# Altium project biv2-LRP_1a.PrjPcb
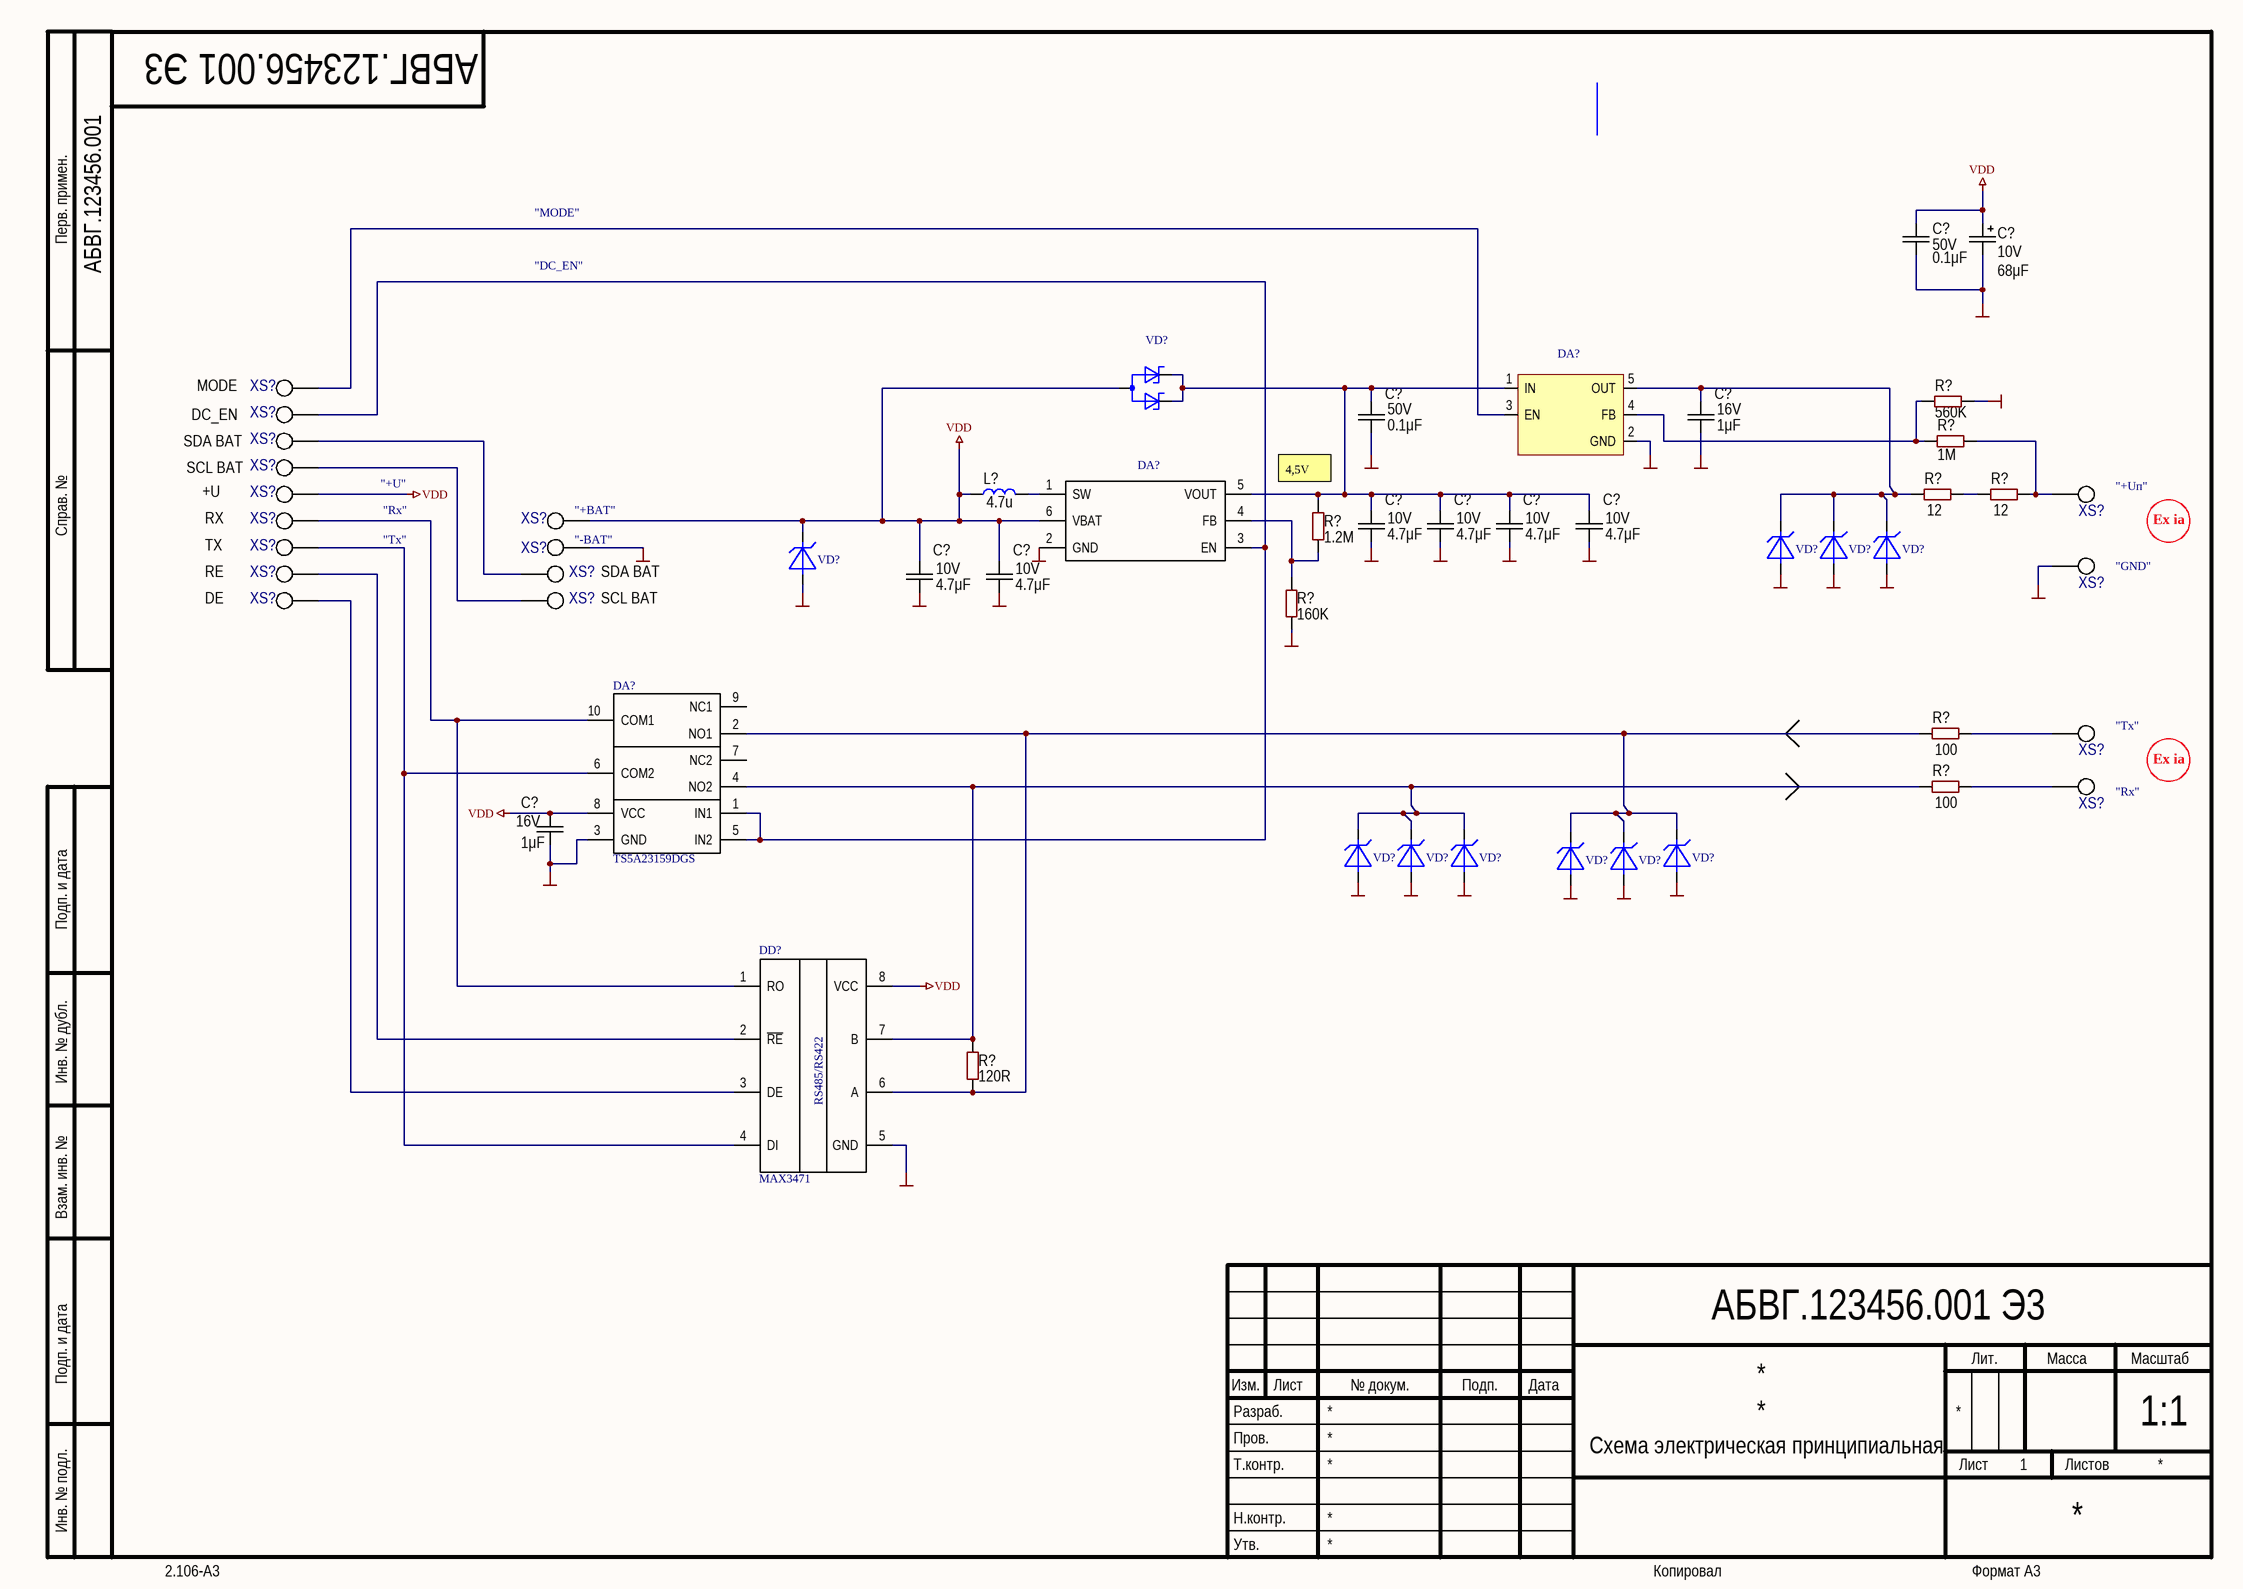
[diagram p0: Sheet1.SchDoc]
1 sheet, 53 parts. Net scope: global (net labels, ports and power ports of the same name join across sheets).
Board file: biv2-LRP_1a.PcbDoc

## Sheet Sheet1.SchDoc
size 420 x 297 mm; Address1: Address1; Address2: Address2; Address3: Address3; Address4: Address4; DocumentNumber: АБВГ.123456.001 Э3; SheetNumber: 1; Scale: 1:1; DocumentType: Схема электрическая принципиальная; FirstReferrence: АБВГ.123456.001

### Parts
(Parts that share a designator on the sheet are numbered #1, #2 ... from top to bottom, then left to right.)
C11  value 68μF  Voltage: 10V  [CAP: TANTAL-B]
C?#1  value 0.1μF  Voltage: 50V  [CAP: 0603]
C?#2  value 0.1μF  Voltage: 50V  [CAP: 0603]
C?#3  value 1μF  Voltage: 16V  [CAP: 0603]
C?#4  value 4.7μF  Voltage: 10V  [CAP: 0603]
C?#5  value 4.7μF  Voltage: 10V  [CAP: 0603]
C?#6  value 4.7μF  Voltage: 10V  [CAP: 0603]
C?#7  value 4.7μF  Voltage: 10V  [CAP: 0603]
C?#8  value 4.7μF  Voltage: 10V  [CAP: 0603]
C?#9  value 4.7μF  Voltage: 10V  [CAP: 0603]
C?#10  value 1μF  Voltage: 16V  [CAP: 0603]
DA1  TS5A23159DGS  [VSSSOP-10 - TI]
DA2  TPS6107x  [SOT23-6]  (value not drawn)
DA3  TPS78001DDC  [SOT23-5]  (value not drawn)
DD1  MAX3471  [MSOP-8]
L1  value 4.7u  [IND: CDRH4D28NP]  (hidden comment: CDRH4D)
R1  value 120R  [RES: 0603]
R2  value 160K  [RES: 0603]
R3  value 1.2M  [RES: 0603]
R4  value 12  [RES: 2512]
R5  value 100  [RES: 2512]
R6  value 100  [RES: 2512]
R7  value 560K  [RES: 0603]
R8  value 1M  [RES: 0603]
R9  value 12  [RES: 2512]
VD1  SM2T  [DO216-AA]  (value not drawn)
VD2  BAT54AW  [SC-70]  (value not drawn)
VD3  SM2T  [DO216-AA]  (value not drawn)
VD4  SM2T  [DO216-AA]  (value not drawn)
VD5  SM2T  [DO216-AA]  (value not drawn)
VD6  SM2T  [DO216-AA]  (value not drawn)
VD7  SM2T  [DO216-AA]  (value not drawn)
VD8  SM2T  [DO216-AA]  (value not drawn)
VD9  SM2T  [DO216-AA]  (value not drawn)
VD10  SM2T  [DO216-AA]  (value not drawn)
VD11  SM2T  [DO216-AA]  (value not drawn)
XS?#1  Testpoint_HS1mm  [TestPoint(1mm_HS)]  (value not drawn)
XS?#2  Testpoint_HS1mm  [TestPoint(1mm_HS)]  (value not drawn)
XS?#3  Testpoint_HS1mm  [TestPoint(1mm_HS)]  (value not drawn)
XS?#4  Testpoint_HS1mm  [TestPoint(1mm_HS)]  (value not drawn)
XS?#5  Testpoint_HS1mm  [TestPoint(1mm_HS)]  (value not drawn)
XS?#6  Testpoint_HS1mm  [TestPoint(1mm_HS)]  (value not drawn)
XS?#7  Testpoint_HS1mm  [TestPoint(1mm_HS)]  (value not drawn)
XS?#8  Testpoint_HS1mm  [TestPoint(1mm_HS)]  (value not drawn)
XS?#9  Testpoint_HS1mm  [TestPoint(1mm_HS)]  (value not drawn)
XS?#10  Testpoint_HS1mm  [TestPoint(1mm_HS)]  (value not drawn)
XS?#11  Testpoint_HS1mm  [TestPoint(1mm_HS)]  (value not drawn)
XS?#12  Testpoint_HS1mm  [TestPoint(1mm_HS)]  (value not drawn)
XS?#13  Testpoint_HS1mm  [TestPoint(1mm_HS)]  (value not drawn)
XS?#14  Testpoint_HS1mm  [TestPoint(1mm_HS)]  (value not drawn)
XS?#15  Testpoint_HS1mm  [TestPoint(1mm_HS)]  (value not drawn)
XS?#16  Testpoint_HS1mm  [TestPoint(1mm_HS)]  (value not drawn)
XS?#17  Testpoint_HS1mm  [TestPoint(1mm_HS)]  (value not drawn)

### Nets
GND: C11.2 C?#1.1 C?#2.1 C?#3.1 C?#4.1 C?#5.1 C?#6.1 C?#7.1 C?#8.1 C?#9.1 C?#10.1 DA1.3(GND) DA2.2(GND) DA3.2(GND) DD1.5(GND) R2.1 R7.1 VD1.2(A) VD3.2(A) VD4.2(A) VD5.2(A) VD6.2(A) VD7.2(A) VD8.2(A) VD9.2(A) VD10.2(A) VD11.2(A) XS?#10.1 XS?#11.1
VDD: C11.1 C?#1.2 C?#8.2 C?#9.2 C?#10.2 DA1.8(VCC) DA2.6(VBAT) DD1.8(VCC) L1.1 VD1.1(C) VD2.3(OA) XS?#5.1 XS?#8.1
NetC?#2_2: C?#2.2 C?#4.2 C?#5.2 C?#6.2 C?#7.2 DA2.5(VOUT) DA3.1(IN) R3.2 VD2.1(C) VD2.2(C)
NetC?#3_2: C?#3.2 DA3.5(OUT) R4.1 VD9.1(C) VD10.1(C) VD11.1(C)
NetDA1_1: DA1.1(IN1) DA1.5(IN2) DA2.3(EN) XS?#2.1
NetDA1_2: DA1.2(NO1) DD1.6(A) R1.1 R5.1 VD6.1(C) VD7.1(C) VD8.1(C)
NetDA1_4: DA1.4(NO2) DD1.7(B) R1.2 R6.1 VD3.1(C) VD4.1(C) VD5.1(C)
NetDA1_6: DA1.6(COM2) DD1.4(DI) XS?#9.1
NetDA1_10: DA1.10(COM1) DD1.1(RO) XS?#7.1
NetDA2_1: DA2.1(SW) L1.2
NetDA2_4: DA2.4(FB) R2.2 R3.1
NetDA3_3: DA3.3(EN) XS?#1.1
NetDA3_4: DA3.4(FB) R7.2 R8.2
NetDD1_2: DD1.2(~{RE}) XS?#12.1
NetDD1_3: DD1.3(DE) XS?#14.1
NetR4_2: R4.2 R9.1
NetR5_2: R5.2 XS?#16.1
NetR6_2: R6.2 XS?#17.1
NetR8_1: R8.1 R9.2 XS?#6.1
NetXS?#3_1: XS?#3.1 XS?#13.1
NetXS?#4_1: XS?#4.1 XS?#15.1

Not connected (* = marked no-connect by the designer): DA1 7(NC2) 9(NC1)

### Notes on the sheet
- "MODE"
- "DC_EN"
- MODE
- (near XS?#3) SDA BAT
- DC_EN
- (near XS?#4) SCL BAT
- +U
- RX
- "+U"
- "Rx"
- (near XS?#8) "+BAT"
- (near R3) 4,5V
- (near XS?#6) "+Uп"
- Ex ia
- TX
- RE
- "Tx"
- (near XS?#10) "-BAT"
- (near XS?#10) SDA BAT
- (near XS?#11) "GND"
- DE
- (near XS?#15) SCL BAT
- (near XS?#16) "Tx"
- (near XS?#17) "Rx"
- Перв. примен.
- Справ. №
- Подп. и дата
- Инв. № дубл.
- Взам. инв. №
- Разраб.
- Изм.
- Лист
- № докум.
- Подп.
- Дата
- Лит.
- Масса
- Масштаб
- Пров.
- Т.контр.
- Листов
- Инв. № подл.
- Утв.
- Н.контр.
- 2.106-A3
- Копировал
- Формат А3
- (in symbol MAX3471) RS485/RS422

### Library data of the parts
C11 = Tantal_B: Manufacturer: AVX; PartNumber: F930J227KBA; ValueManufacturerPartNumber: Tantalum capacitor, 68μF, 10V, ±10%, 1.2Ohm, case B (3528), -55...+125°C; Impedance: 1.2Ohm; Tolerance: ±10%; TypeDielectric: X7R; TypeCapacitor: Tantalum capacitor; Package: 0603; HelpURL: https://www.digikey.com/product-detail/en/yageo/CC0603KRX7R7BB104/311-1088-1-ND/302998; Temperature: -55...+125°C
C?#1 C?#2 = Ceramic_0603: Manufacturer: Yageo; PartNumber: CC0603KRX7R7BB104; ValueManufacturerPartNumber: Ceramic capacitor, 0.1μF, X7R, ±10%, 50V, 0603, -55...+125°C; TypeCapacitor: Ceramic capacitor; Tolerance: ±10%; TypeDielectric: X7R; Package: case B (3528); HelpURL: https://www.digikey.com/product-detail/en/avx-corporation/F930J227KBA/478-8166-1-ND/4005570; Temperature: -55...+125°C
C?#3 C?#10 = Ceramic_0603: Manufacturer: Yageo; PartNumber: CC0603KRX7R7BB104; ValueManufacturerPartNumber: Ceramic capacitor, 1μF, X7R, ±10%, 16V, 0603, -55...+125°C; TypeCapacitor: Ceramic capacitor; Tolerance: ±10%; TypeDielectric: X7R; Package: 0603; HelpURL: https://www.digikey.com/product-detail/en/yageo/CC0603KRX7R7BB104/311-1088-1-ND/302998; Temperature: -55...+125°C
C?#4-C?#9 = Ceramic_0603: Manufacturer: Yageo; PartNumber: CC0603KRX7R7BB104; ValueManufacturerPartNumber: Ceramic capacitor, 4.7μF, X7R, ±10%, 10V, 0603, -55...+125°C; TypeCapacitor: Ceramic capacitor; Tolerance: ±10%; TypeDielectric: X7R; Package: 0603; HelpURL: https://www.digikey.com/product-detail/en/yageo/CC0603KRX7R7BB104/311-1088-1-ND/302998; Temperature: -55...+125°C
DA1 = TS5A23159DGS: Микросхема; Manufacturer: Texas Instruments; ComponentLink1Description: Data Sheet; ComponentLink1URL: http://focus.ti.com/lit/ds/symlink/tps780270200.pdf
DA2 = TPS61070: Микросхема; Manufacturer: Texas Instruments; ComponentLink1Description: Data Sheet; ComponentLink3URL: *; ReplacementPart1Manufacturer: *; ReplacementPart1PartNumber: *; ReplacementPart1TopMarking: *; ReplacementPart2Manufacturer: *; ReplacementPart2PartNumber: *; ReplacementPart2TopMarking: *; TopMarking: *; PartNumber: TPS6107x
DA3 = TPS78001DDC: Микросхема; Manufacturer: Texas Instruments; Part Number: TPS780270200DDCT; PartNumber: TS5A23159DGS
DD1 = MAX3471: RS-485/RS422Half-Duplex,  Differential Transceiver for Battery-Powered Systems; Manufacturer: MAXIM; ComponentLink1Description: Data Sheet; ComponentLink1URL: \\Mskd20virt\KB\PDF\Интерфейсы\RS232_485\MAX3471.pdf; ComponentLink2Description: Replacement 1 Data Sheet; PartNumber: MAX3471
L1 = CDRH4D28NP: ComponentLink1Description: Datasheet; ComponentLink1URL: https://products.sumida.com/products/pdf/CDRH4D28.pdf
R1 = Resistor_0603: Manufacturer: Yageo; PartNumber: RC0603JR-07100RL; ValueManufacturerPartNumber: Resistor film, 120R, ±5%, 0603, 0.1W, -55...+125°C; TypeResistor: Resistor film; Power: 0.1W; Tolerance: ±5%; Package: 0603; HelpURL: https://www.digikey.com/product-detail/en/yageo/RC0603JR-07100RL/311-100GRCT-ND/729644; Temperature: -55...+125°C
R2 = Resistor_0603: Manufacturer: Yageo; PartNumber: RC0603JR-07100RL; ValueManufacturerPartNumber: Resistor film, 160K, ±5%, 0603, 0.1W, -55...+125°C; TypeResistor: Resistor film; Power: 0.1W; Tolerance: ±5%; Package: 0603; HelpURL: https://www.digikey.com/product-detail/en/yageo/RC0603JR-07100RL/311-100GRCT-ND/729644; Temperature: -55...+125°C
R3 = Resistor_0603: Manufacturer: Yageo; PartNumber: RC0603JR-07100RL; ValueManufacturerPartNumber: Resistor film, 1.2M, ±5%, 0603, 0.1W, -55...+125°C; TypeResistor: Resistor film; Power: 0.1W; Tolerance: ±5%; Package: 2512; HelpURL: https://www.digikey.com/product-detail/en/yageo/RC2512JK-07100RL/YAG3393CT-ND/5962215; Temperature: -55...+125°C
R4 R9 = Resistor_2512: Manufacturer: Yageo; PartNumber: RC2512JK-07100RL; ValueManufacturerPartNumber: Resistor film, 12, ±5%, 2512, 1W, -55...+125°C; TypeResistor: Resistor film; Power: 1W; Tolerance: ±5%; Package: 0603; HelpURL: https://www.digikey.com/product-detail/en/yageo/RC0603JR-07100RL/311-100GRCT-ND/729644; Temperature: -55...+125°C
R5 R6 = Resistor_2512: Manufacturer: Yageo; PartNumber: RC2512JK-07100RL; ValueManufacturerPartNumber: Resistor film, 100, ±5%, 2512, 1W, -55...+125°C; TypeResistor: Resistor film; Power: 1W; Tolerance: ±5%; Package: 0603; HelpURL: https://www.digikey.com/product-detail/en/yageo/RC0603JR-07100RL/311-100GRCT-ND/729644; Temperature: -55...+125°C
R7 = Resistor_0603: Manufacturer: Yageo; PartNumber: RC0603JR-07100RL; ValueManufacturerPartNumber: Resistor film, 560K, ±5%, 0603, 0.1W, -55...+125°C; TypeResistor: Resistor film; Power: 0.1W; Tolerance: ±5%; Package: 2512; HelpURL: https://www.digikey.com/product-detail/en/yageo/RC2512JK-07100RL/YAG3393CT-ND/5962215; Temperature: -55...+125°C
R8 = Resistor_0603: Manufacturer: Yageo; PartNumber: RC0603JR-07100RL; ValueManufacturerPartNumber: Resistor film, 1M, ±5%, 0603, 0.1W, -55...+125°C; TypeResistor: Resistor film; Power: 0.1W; Tolerance: ±5%; Package: 0603; HelpURL: https://www.digikey.com/product-detail/en/yageo/RC0603JR-07100RL/311-100GRCT-ND/729644; Temperature: -55...+125°C
VD1 VD3-VD11 = SM2T: TVS Диод; Manufacturer: ST Microelectronics; ComponentLink1Descriprion: Data Sheet; Type: *; Power/Voltage: *; PartNumber: BAT54AW; Package: SC-70; ComponentLink1Description: DataSheet; ComponentLink1URL: http://www.nxp.com/documents/data_sheet/BAT54W.pdf; ComponentLink2URL: http://www.onsemi.com/pub_link/Collateral/BAT54AWT1-D.PDF; ComponentLink3Description: Replacement2DataSheet; ComponentLink3URL: http://www.infineon.com/dgdl/bat54series.pdf?folderId=db3a30431400ef68011425f1ca2505e3&fileId=db3a304314dca3890115190b74210ea6; ComponentLink2Description: Replacement1DataSheet
VD2 = BAT54AW: Сборка диодная; Manufacturer: NXP; ReplacementPart2TopMarking: TA; ReplacementPart1Manufacturer: ON Semiconductor; ReplacementPart1PartNumber: BAT54AWT1G; ReplacementPart1TopMarking: B7*; ReplacementPart2Manufacturer: Infineon; ReplacementPart2PartNumber: BAT54-06W; TopMarking: 42; ComponentLink1URL: *; ComponentLink2Description: Replacement 1 Data Sheet; ComponentLink2URL: *; ComponentLink3Description: Replacement 2 Data Sheet; ComponentLink3URL: *; PartNumber: *; ReplacementPart1Manufacturer: *; ReplacementPart1PartNumber: *; ReplacementPart1TopMarking: *; ReplacementPart2Manufacturer: *; ReplacementPart2TopMarking: *; TopMarking: *; ReplacementPart2PartNumber: *; StandOffVoltage: *